# EAGLE design H08R61 (EAGLE 9.6.1)

## Sheet 1 of 2
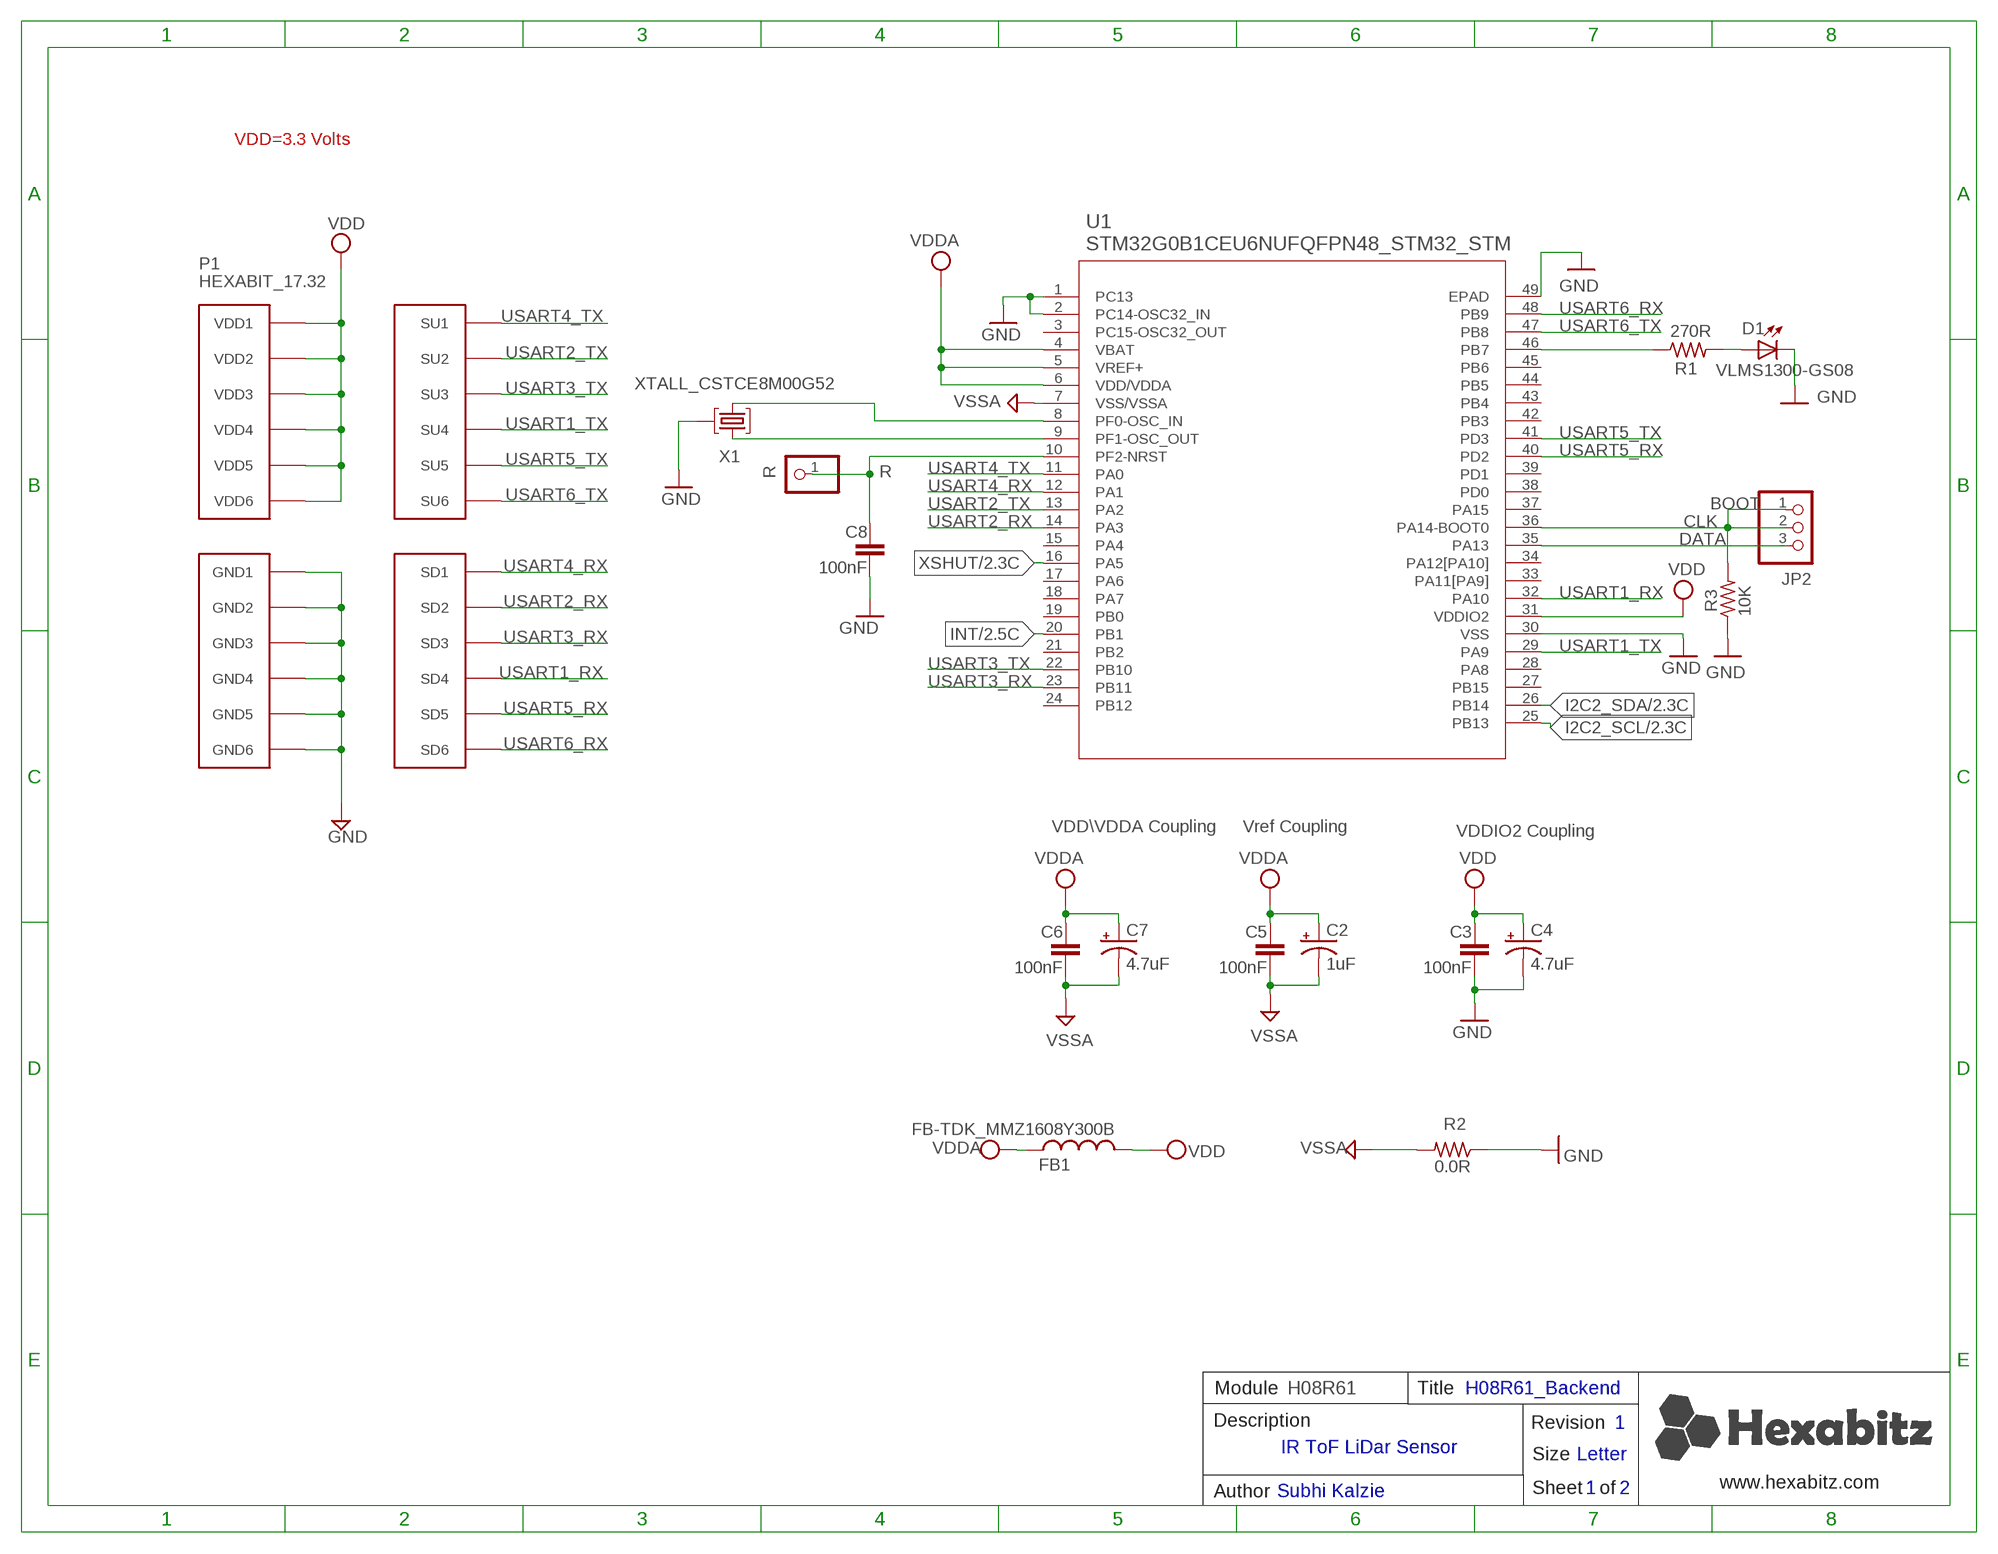
[diagram p0: schematic, sheet 1]

### Parts
C2  1uF  C-0805-POL  [C-0805-POL]
C3  100nF  C-0603  [C-0603]
C4  4.7uF  C-0805-POL  [C-0805-POL]
C5  100nF  C-0603  [C-0603]
C6  100nF  C-0603  [C-0603]
C7  4.7uF  C-0805-POL  [C-0805-POL]
C8  100nF  C-0603  [C-0603]
D1  VLMS1300-GS08  [VLMS1300-GS08]
FB1  FB-TDK_MMZ1608Y300B  [FB-TDK_MMZ1608Y300B]
JP2  PINHD-1X3  [1X03]
P1  HEXABIT_17.32  [HEXABIT_17.32]
R  R  PINHD-1X1  [1X01]
R1  270R  R-0603  [R-0603]
R2  0.0R  R-0603  [R-0603]
R3  10K  R-0603  [R-0603]
U1  STM32G0B1CEU6NUFQFPN48_STM32_STM  [UFQFPN48_STM32_STM]
X1  XTALL_CSTCE8M00G52  [XTALL_CSTCE8M00G52]

### Nets
CLK: JP2.1 JP2.2 R3.2 U1.36(PA14-BOOT0)
DATA: JP2.3 U1.35(PA13)
GND: C3.2 C4.2(-) C8.2 D1.C P1.PAD_PD7(GND1) P1.PAD_PD8(GND2) P1.PAD_PD9(GND3) P1.PAD_PD10(GND4) P1.PAD_PD11(GND5) P1.PAD_PD12(GND6) R2.1 R3.1 U1.1(PC13) U1.2(PC14-OSC32_IN) U1.30(VSS) U1.49(EPAD) X1.P$2 ; also sheet 2
I2C2_SCL: U1.25(PB13) ; also sheet 2
I2C2_SDA: U1.26(PB14) ; also sheet 2
INT: U1.20(PB1) ; also sheet 2
N$3: D1.A R1.2
N$4: C8.1 R.1 U1.10(PF2-NRST)
N$5: U1.9(PF1-OSC_OUT) X1.P$1
N$6: U1.8(PF0-OSC_IN) X1.P$3
N$7: R1.1 U1.46(PB7)
USART1_RX: P1.PAD_PD4(SD4) U1.32(PA10)
USART1_TX: P1.PAD_PU4(SU4) U1.29(PA9)
USART2_RX: P1.PAD_PD2(SD2) U1.14(PA3)
USART2_TX: P1.PAD_PU2(SU2) U1.13(PA2)
USART3_RX: P1.PAD_PD3(SD3) U1.23(PB11)
USART3_TX: P1.PAD_PU3(SU3) U1.22(PB10)
USART4_RX: P1.PAD_PD1(SD1) U1.12(PA1)
USART4_TX: P1.PAD_PU1(SU1) U1.11(PA0)
USART5_RX: P1.PAD_PD5(SD5) U1.40(PD2)
USART5_TX: P1.PAD_PU5(SU5) U1.41(PD3)
USART6_RX: P1.PAD_PD6(SD6) U1.48(PB9)
USART6_TX: P1.PAD_PU6(SU6) U1.47(PB8)
VDD: C3.1 C4.1(+) FB1.2 P1.PAD_PU7(VDD1) P1.PAD_PU8(VDD2) P1.PAD_PU9(VDD3) P1.PAD_PU10(VDD4) P1.PAD_PU11(VDD5) P1.PAD_PU12(VDD6) U1.31(VDDIO2) ; also sheet 2
VDDA: C2.1(+) C5.1 C6.1 C7.1(+) FB1.1 U1.4(VBAT) U1.5(VREF+) U1.6(VDD/VDDA) ; also sheet 2
VSSA: C2.2(-) C5.2 C6.2 C7.2(-) R2.2 U1.7(VSS/VSSA)
XSHUT: U1.16(PA5) ; also sheet 2
Unconnected: U1.3(PC15-OSC32_OUT) U1.15(PA4) U1.17(PA6) U1.18(PA7) U1.19(PB0) U1.21(PB2) U1.24(PB12) U1.27(PB15) U1.28(PA8) U1.33(PA11[PA9]) U1.34(PA12[PA10]) U1.37(PA15) U1.38(PD0) U1.39(PD1) U1.42(PB3) U1.43(PB4) U1.44(PB5) U1.45(PB6)

### Notes on the sheet
- VDD=3.3 Volts
- BOOT
- VDD\VDDA Coupling | Vref Coupling | VDDIO2 Coupling
- Module | H08R61 | Title | H08R61_Backend
- Description | Revision | 1
- IR ToF LiDar Sensor
- Size | Letter
- www.hexabitz.com
- Author | Subhi Kalzie | Sheet   of | 1 | 2
- C:/Users/Admin/Desktop/logodraft.bmp

## Sheet 2 of 2
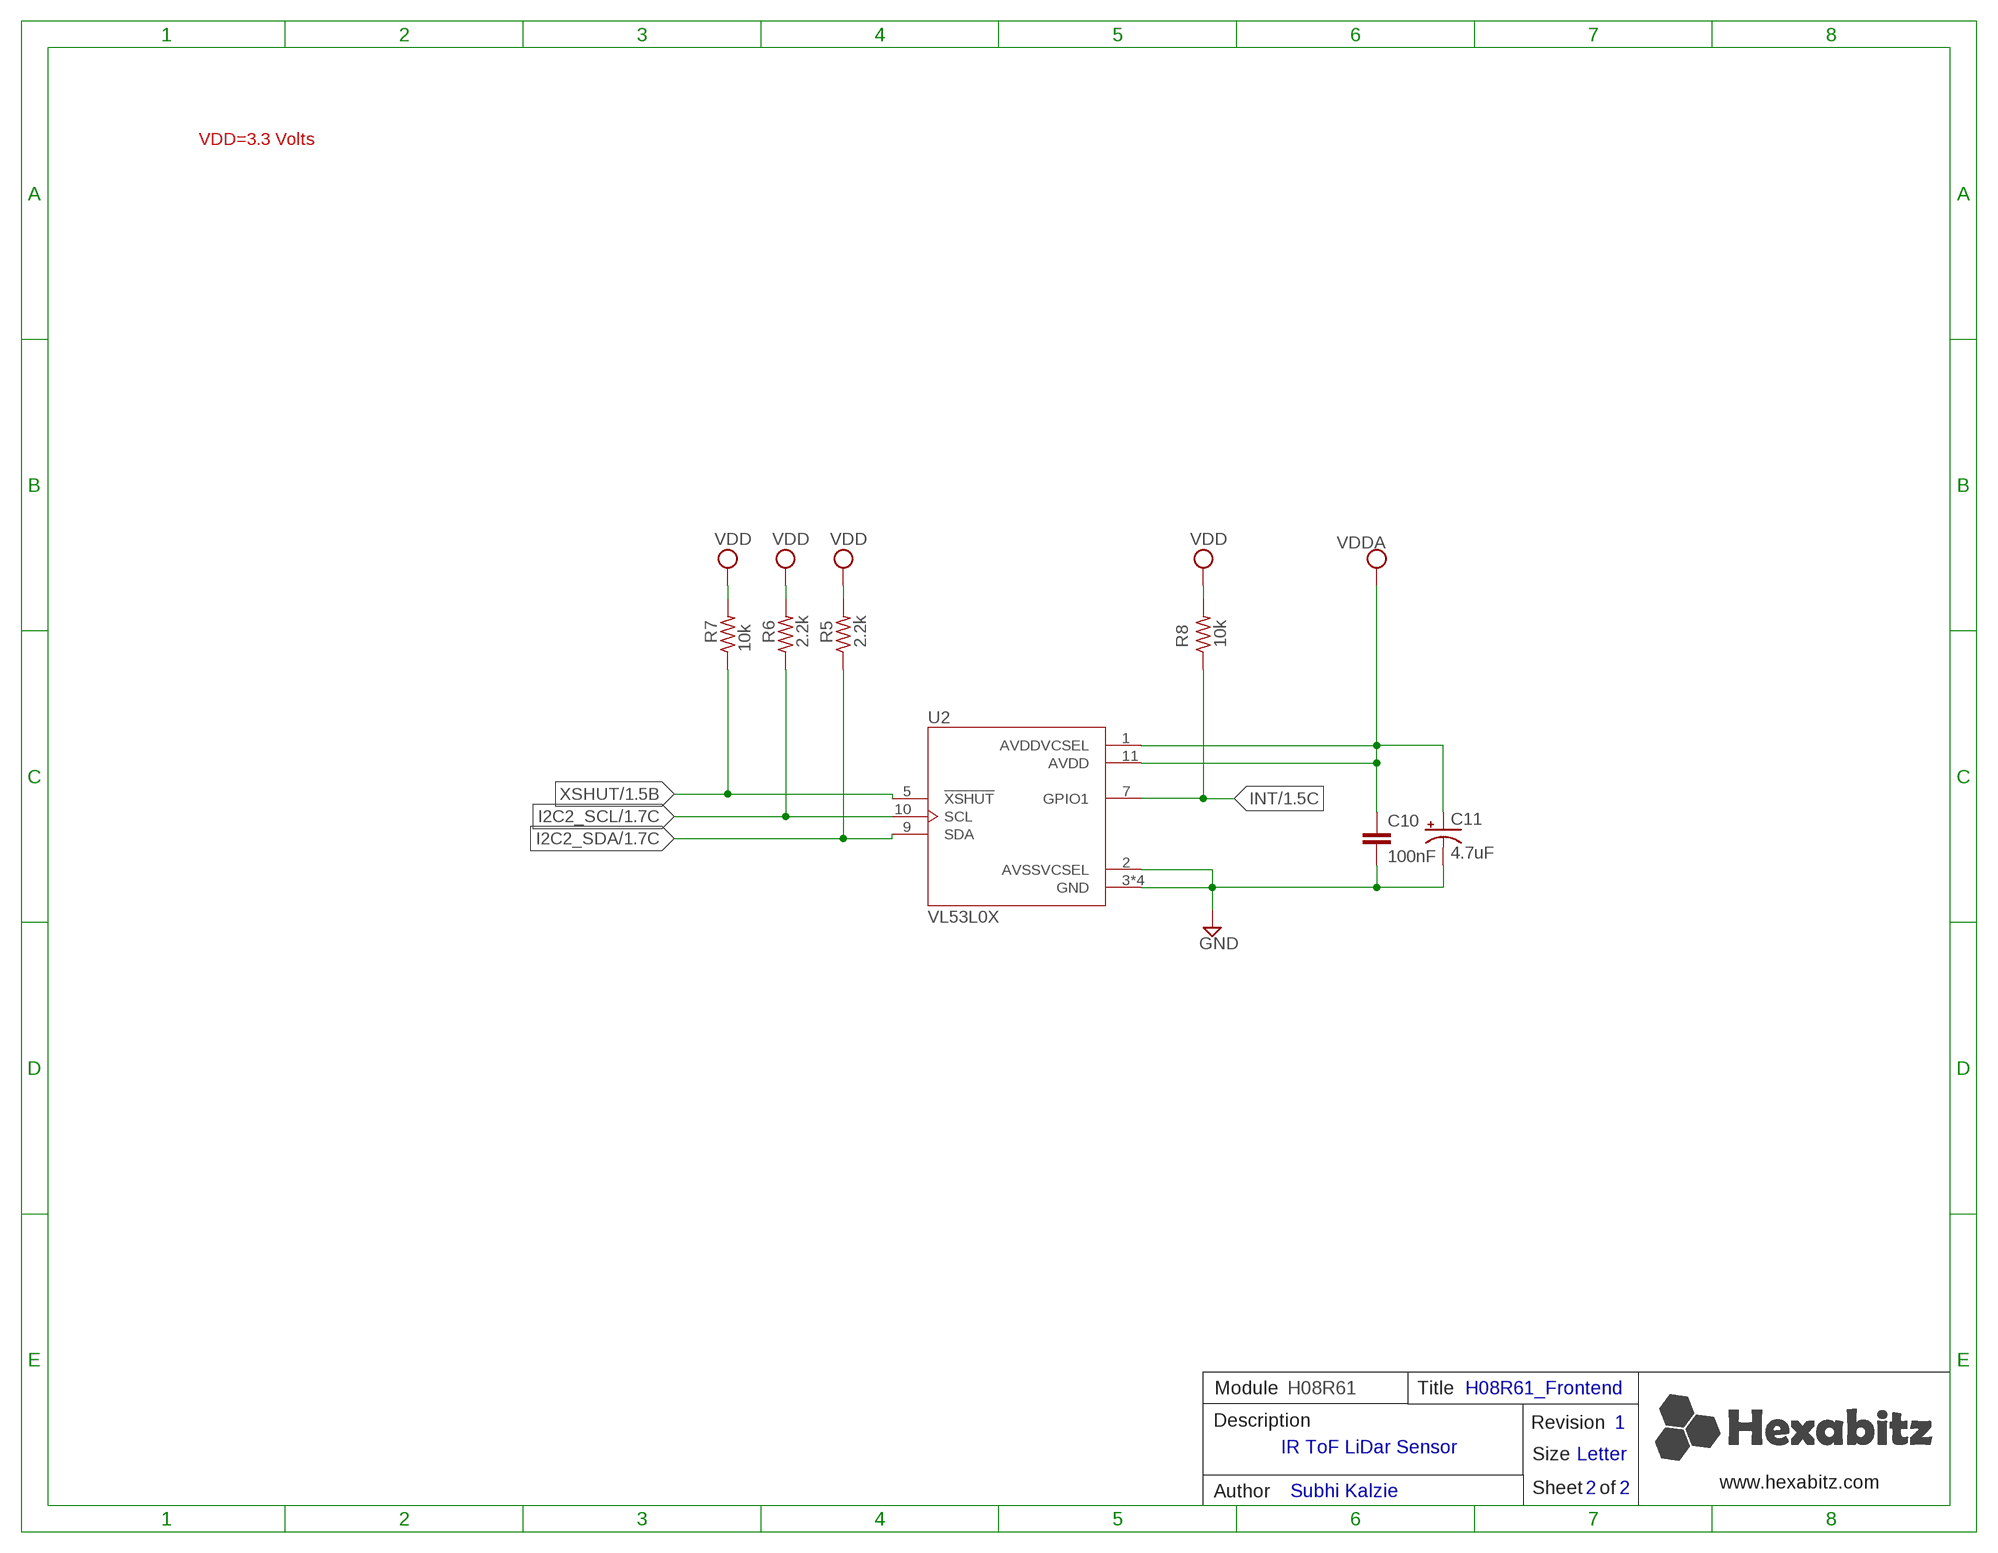
[diagram p1: schematic, sheet 2]

### Parts
C10  100nF  C-0603  [C-0603]
C11  4.7uF  C-0805-POL  [C-0805-POL]
R5  2.2k  R-0603  [R-0603]
R6  2.2k  R-0603  [R-0603]
R7  10k  R-0603  [R-0603]
R8  10k  R-0603  [R-0603]
U2  VL53L0X  [SENSOR_VL53L0X]

### Nets
GND: C10.2 C11.2(-) U2.2(AVSSVCSEL) U2.3(GND) U2.4(GND) U2.6(GND) U2.12(GND) ; also sheet 1
I2C2_SCL: R6.1 U2.10(SCL) ; also sheet 1
I2C2_SDA: R5.1 U2.9(SDA) ; also sheet 1
INT: R8.1 U2.7(GPIO1) ; also sheet 1
VDD: R5.2 R6.2 R7.2 R8.2 ; also sheet 1
VDDA: C10.1 C11.1(+) U2.1(AVDDVCSEL) U2.11(AVDD) ; also sheet 1
XSHUT: R7.1 U2.5(!XSHUT) ; also sheet 1

### Notes on the sheet
- VDD=3.3 Volts
- Module | H08R61 | Title | H08R61_Frontend
- Description | Revision | 1
- IR ToF LiDar Sensor
- Size | Letter
- www.hexabitz.com
- Author | Subhi Kalzie | Sheet   of | 2 | 2

## Library data of the parts
C2 C4 C7 C11 = HEXABITZ_RCLS:C-0805-POL: Cap Tant Solid SMD 2012
C3 C5 C6 C8 C10 = HEXABITZ_RCLS:C-0603: CAP CER 10% X7R 0603
D1 = Hexabitz:VLMS1300-GS08: Red 0603 130° Clear 54 mcd 2 V Surface Mount ChipLED ; Octopart Url : http://octopart.com/vlms1300-gs08-vishay-21709201; MFN: Vishay; MPN: VLMS1300-GS08; OCTOPART_URL: https://octopart.com/vlms1300-gs08-vishay-21709201?r=sp&s=_gcP4_q8T1SC6PJQPTQ9yA
FB1 = HEXABITZ_RCLS:FB-TDK_MMZ1608Y300B: Ferrite Beads Multi-Layer 30Ohm 25% 100MHz 1.5A 50mOhm DCR 0603; MFN: TDK; MPN: MMZ1608Y300B; OCTOPART_URL: https://octopart.com/mmz1608y300b-tdk-368280?r=sp&s=cd9_2ZEqQ9q9UNBuQgHAiA
JP2 = pinhead:PINHD-1X3: PIN HEADER
P1 = hexabitz_connectors:HEXABIT_?: Hexabitz Hexagon Module Connector Hexagon side length = 28.87mm.
R = HEXABITZ_USER_INTERFACE_PARTS:PINHD-1X1: PIN HEADER; MFN: TE Connectivity; MPN: 87227-1; OCTOPART_URL: https://octopart.com/87227-1-te+connectivity-39512052?r=sp
R1 R3 R5-R8 = HEXABITZ_RCLS:R-0603: Thick Film Resistors - SMD 0603
R2 = HEXABITZ_RCLS:R-0603: Thick Film Resistors - SMD 0603; MFN: Yageo; MPN: RC0603JR-070RL; OCTOPART_URL: https://octopart.com/rc0603jr-070rl-yageo-1241539?r=sp&s=X2NteqRjRNWrnx42Y0aliA; RESISTANCE: 0.0 Ohm
U1 = HEXABITZ_ICs:STM32G0B1CEU6N; COPYRIGHT: Copyright (C) 2022 Ultra Librarian. All rights reserved.; MFN: STMicroelectronics; MPN: STM32G0B1CEU6N; OCTOPART_URL: https://app.ultralibrarian.com/details/c038d58b-752a-11eb-9033-0a34d6323d74/STMicroelectronics/STM32G0B1CEU6N?uid=116364672
U2 = HEXABITZ_ICs:VL53L0X: Time-of-Flight Ranging & Gesture Detection Sensor; MFN: STMicroelectronics; MPN: VL53L0CXV0DH/1; OCTOPART_URL: http://octopart.com/vl53l0cxv0dh%2F1-stmicroelectronics-71168165
X1 = Hexabitz:XTALL_CSTCE8M00G52: MURATA CSTCE8M00G52-R0 RESONATOR, SMD, 8MHZ ; Octopart Url : https://octopart.com/cstce8m00g52-r0-murata-7145559; MFN: Murata; MPN: CSTCE8M00G52Z-R0; OCTOPART_URL: https://octopart.com/cstce8m00g52z-r0-murata-17755941?r=sp&s=JDnNJnrHQhyS8Zk4ofFWXw

## Board
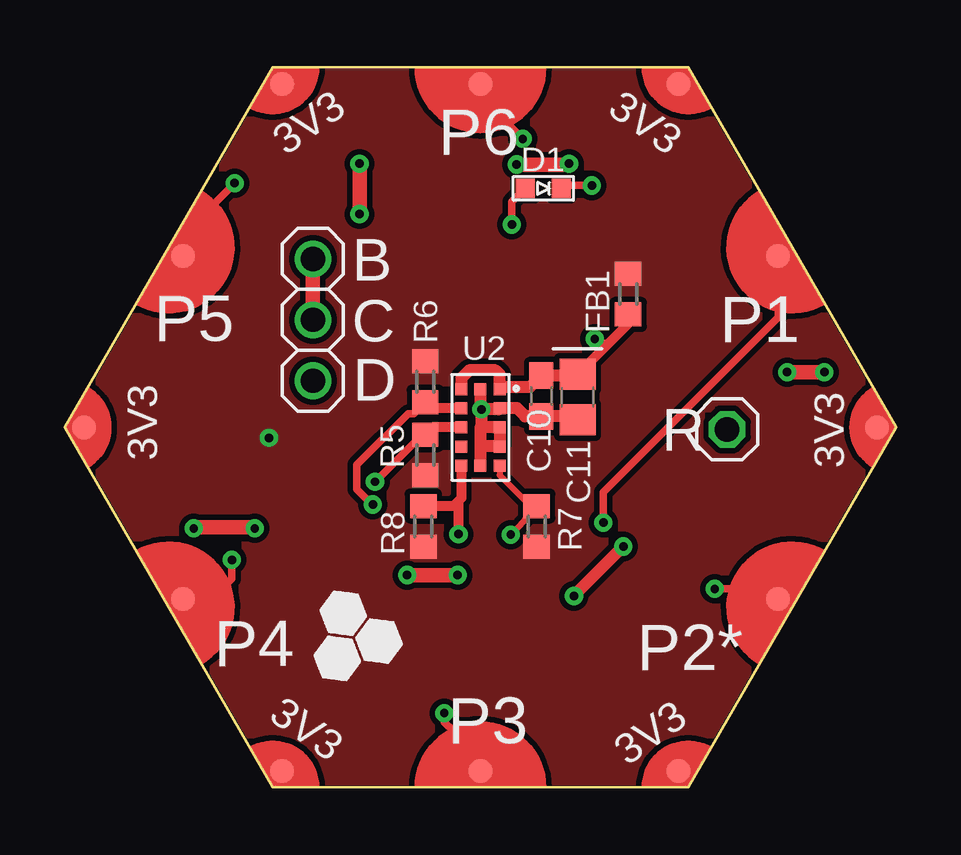
[diagram p2: board, top side]
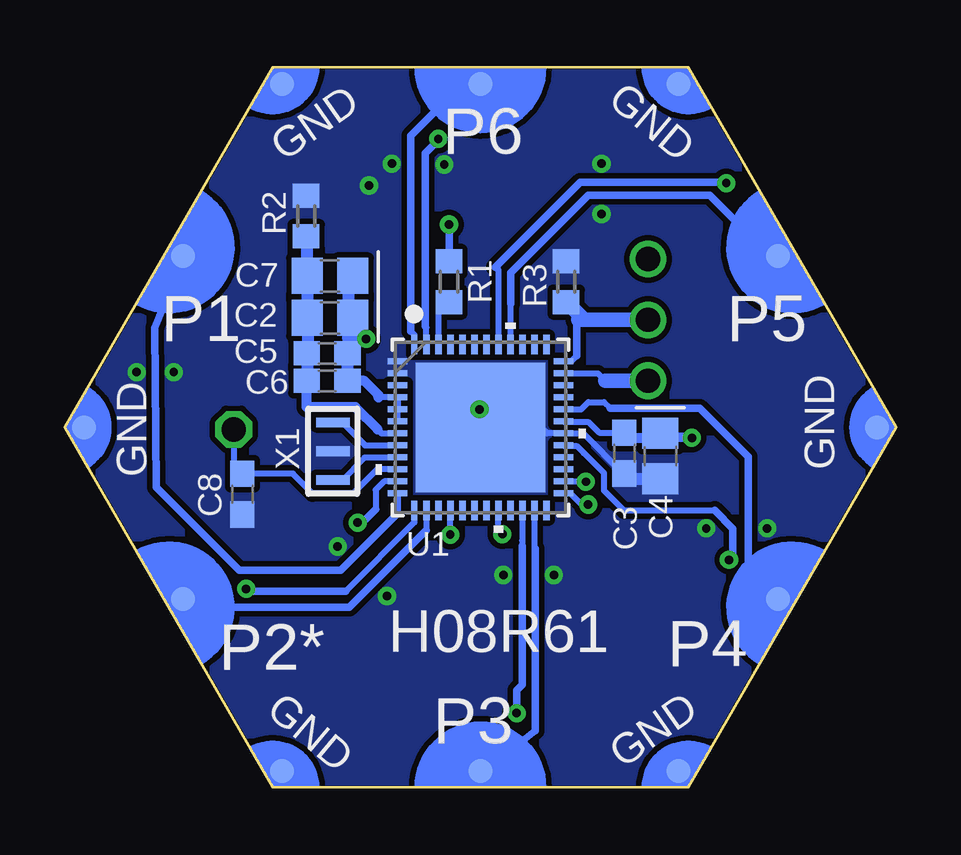
[diagram p3: board, bottom side, seen from below]

Size 34.64 x 30 mm. Coordinates in mm from the lower left corner, seen from the top.
Copper layers (1*16): Top 0.035mm / dielectric 1.5mm / Bottom 0.035mm
Design rules "default *": minimum track width 6mil, minimum drill 0.35mm, track to track 9mil, track to pad 9mil, pad to pad 6mil, via to via 6mil, smd to smd 0mil, copper to edge 1mil, drill to drill 1mil, minimum pad ring 10mil, minimum via ring 8mil, stop-mask expansion 4mil, vias tented up to drill 25mil, thermal gap 10mil

### Footprints (pad centres in the part's own frame; a part is rotated, then mirrored left to right if it is on the bottom)
C-0805-POL = smd 1.3 x 1.5: 1 -0.95,0; 2 0.95,0
C-0603 = smd 1.1 x 1: 1 -0.85,0; 2 0.85,0
VLMS1300-GS08 = smd 0.8 x 0.8: A 0,0.75; C 0,-0.75
FB-TDK_MMZ1608Y300B = smd 1 x 1.1: 1 -0.85,0; 2 0.85,0
1X03 = drill 1.016: 1 -2.54,0; 2 0,0; 3 2.54,0
HEXABIT_17.32 = smd 1 x 1 bottom: PAD_PD1 12.39,7.15; PAD_PD2 12.39,-7.15; PAD_PD3 0,-14.31; PAD_PD4 -12.39,-7.15; PAD_PD5 -12.39,7.15; PAD_PD6 0,14.31; PAD_PD7 8.26,14.31; PAD_PD8 16.52,0; PAD_PD9 8.26,-14.31; PAD_PD10 -8.26,-14.31; PAD_PD11 -16.52,0; PAD_PD12 -8.26,14.31 | smd 1 x 1: PAD_PU1 12.39,7.15; PAD_PU2 12.39,-7.15; PAD_PU3 0,-14.31; PAD_PU4 -12.39,-7.15; PAD_PU5 -12.39,7.15; PAD_PU6 0,14.31; PAD_PU7 8.26,14.31; PAD_PU8 16.52,0; PAD_PU9 8.26,-14.31; PAD_PU10 -8.26,-14.31; PAD_PU11 -16.52,0; PAD_PU12 -8.26,14.31
1X01 = drill 1.016 octagon: 1 0,0
R-0603 = smd 1 x 1.1: 1 -0.85,0; 2 0.85,0
UFQFPN48_STM32_STM = smd 0.813 x 0.254: 1 -3.454,2.751; 2 -3.454,2.251; 3 -3.454,1.75; 4 -3.454,1.25; 5 -3.454,0.75; 6 -3.454,0.25; 7 -3.454,-0.25; 8 -3.454,-0.75; 9 -3.454,-1.25; 10 -3.454,-1.75; 11 -3.454,-2.251; 12 -3.454,-2.751; 25 3.454,-2.751; 26 3.454,-2.251; 27 3.454,-1.75; 28 3.454,-1.25; 29 3.454,-0.75; 30 3.454,-0.25; 31 3.454,0.25; 32 3.454,0.75; 33 3.454,1.25; 34 3.454,1.75; 35 3.454,2.251; 36 3.454,2.751 | smd 0.254 x 0.813: 13 -2.751,-3.454; 14 -2.251,-3.454; 15 -1.75,-3.454; 16 -1.25,-3.454; 17 -0.75,-3.454; 18 -0.25,-3.454; 19 0.25,-3.454; 20 0.75,-3.454; 21 1.25,-3.454; 22 1.75,-3.454; 23 2.251,-3.454; 24 2.751,-3.454; 37 2.751,3.454; 38 2.251,3.454; 39 1.75,3.454; 40 1.25,3.454; 41 0.75,3.454; 42 0.25,3.454; 43 -0.25,3.454; 44 -0.75,3.454; 45 -1.25,3.454; 46 -1.75,3.454; 47 -2.251,3.454; 48 -2.751,3.454 | smd 5.385 x 5.385: 49 0,0
SENSOR_VL53L0X = smd 0.5 x 0.5: 1 -1.6,0.8; 2 -0.8,0.8; 3 0,0.8; 4 0.8,0.8; 5 1.6,0.8; 6 1.6,0; 7 1.6,-0.8; 8 0.8,-0.8; 9 0,-0.8; 10 -0.8,-0.8; 11 -1.6,-0.8; 12 -1.6,0
XTALL_CSTCE8M00G52 = smd 1.4 x 0.4: P$1 0,1.2; P$2 0,0; P$3 0,-1.2

### Placement (x,y rotation side)
C2  23.59,19.56 180 bottom
C3  11.33,13.93 270 bottom
C4  9.82,13.81 270 bottom
C5  23.71,18.1 180 bottom
C6  23.71,16.94 180 bottom
C7  23.59,21.31 180 bottom
C8  27.24,12.22 270 bottom
C10  19.86,16.31 270 top
C11  21.37,16.27 270 top
D1  19.94,24.96 90 top
FB1  23.47,20.56 90 top
JP2  10.34,19.48 270 top
P1  17.32,15 0 top
R  27.6,14.92 0 top
R1  18.63,21.07 90 bottom
R2  24.58,23.81 270 bottom
R3  13.75,21.07 270 bottom
R5  15.02,13.85 270 top
R6  15.02,16.91 90 top
R7  19.66,10.87 270 top
R8  14.94,10.87 270 top
U1  17.32,15 0 bottom
U2  17.32,15 270 top
X1  23.47,14.01 180 bottom

### Tracks (layer width: path | path; a pad name or v marks a point on that pad's centre or on a via)
CLK
  Top 0.61: JP2.2 JP2.1
  Bottom 0.254: 13.31,17.98 13.54,17.75 U1.36
  Bottom 0.305: 13.13,19.6 13.25,19.48 13.31,19.42 13.31,17.98
  Bottom 0.61: R3.2 13.13,19.6 | JP2.2 13.25,19.48
DATA
  Bottom 0.254: U1.35 12.43,17.25 12.12,16.95
  Bottom 0.61: JP2.3 12.12,16.95
GND  (via drill 0.35)
  Top 0.254: 16.43,8.79 v16.37,8.85 | v21.01,25.99 20.97,25.95
  Top 0.305: v21.96,25.08 20.81,25.08 D1.C
  Top 0.508: C11.2 21.23,15.46 C10.2 19.19,15.46 18.84,15.8 U2.2 18.07,15.75 v17.36,15.75 | U2.12 17.32,15.75 v17.36,15.75 | v23.27,10.04 v21.21,7.98 | v17.36,15.75 17.36,15 | 17.32,14.21 U1.49 17.36,15 | 17.32,14.21 U2.6 | 17.36,15 U2.3 U2.4 17.32,14.21
  Top 0.61: v5.37,10.79 5.41,10.83 7.87,10.83 v7.91,10.79 | v16.37,8.85 v14.26,8.85 | v31.65,17.3 v30.1,17.3 | v12.28,25.99 v12.28,23.89 | 20.97,25.95 v18.83,25.95
  Bottom 0.254: C3.2 11.36,13.08 13.03,14.75 U1.30 14.54,14.75 14.79,15 U1.49
  Bottom 0.406: C3.2 11.07,12.82
  Bottom 0.508: C3.2 11.11,12.86 C4.2
  pour Bottom (no thermals): 0.09,14.88 8.55,30.04 26.04,30.04 34.62,14.95 26.08,0.08 8.75,0.08
I2C2_SCL  (via drill 0.35)
  Top 0.305: R6.1 14.54,15.58 14.31,15.58 12.17,13.44 12.17,12.42 12.61,11.98 12.65,11.98 v12.84,11.79
  Top 0.406: U2.10 15.27,15.8 R6.1
  Bottom 0.254: U1.25 13.58,12.25 13.03,11.71 12.91,11.71 v12.84,11.79
I2C2_SDA  (via drill 0.35)
  Top 0.254: U2.9 16.44,15.08
  Top 0.305: v12.93,12.73 14.89,14.7 R5.1
  Top 0.406: U2.9 15.32,15 R5.1
  Bottom 0.254: U1.26 12.94,12.75 v12.93,12.73
INT  (via drill 0.35)
  Top 0.254: 14.94,11.74 R8.1
  Top 0.406: U2.7 16.52,12.06 16.41,11.94 | R8.1 16.19,11.72 16.41,11.94 | v16.41,10.55 16.41,11.94
  Bottom 0.254: v16.41,10.55 16.57,10.72 U1.20
N$3  (via drill 0.35)
  Top 0.305: v18.63,23.45 18.63,24.4 D1.A
  Bottom 0.305: v18.63,23.45 R1.2
N$4
  Bottom 0.254: U1.10 21.63,13.25 22.62,12.25 24.32,12.25 25.14,13.07 C8.1 27.6,13.43 R.1
N$5
  Bottom 0.254: U1.9 22.14,13.75 23.08,12.81 X1.P$1
N$6
  Bottom 0.254: X1.P$3 23.08,15.21 22.13,14.25 U1.8
N$7
  Bottom 0.254: U1.46 19.07,19.79 R1.1
USART1_RX
  Bottom 0.254: P1.PAD_PD4 6.17,9.09 | U1.32 13.12,15.75 12.82,16.05 12.17,16.05 11.92,15.79
  Bottom 0.305: 6.17,9.09 6.17,13.77 8.19,15.79 11.92,15.79
USART1_TX  (via drill 0.35)
  Top 0.254: P1.PAD_PU4 6.12,7.85
  Top 0.305: v6.96,9.48 6.96,8.69 6.12,7.85
  Bottom 0.254: U1.29 13.85,14.23 13.31,14.23 13.02,13.95 12.18,13.11 12.18,12.38 11.35,11.55 7.56,11.55
  Bottom 0.305: 7.56,11.55 6.8,10.79 6.8,9.64 v6.96,9.48
USART2_RX
  Bottom 0.254: U1.14 19.57,10.72 | P1.PAD_PD2 29.36,7.5
  Bottom 0.305: 19.57,10.72 22.79,7.5 29.36,7.5
USART2_TX  (via drill 0.35)
  Top 0.254: P1.PAD_PU2 29.36,8.2 28.19,8.2 28.12,8.28
  Top 0.305: 28.12,8.28 v27.08,8.28
  Bottom 0.254: v27.08,8.28 27.08,8.17 | U1.13 20.07,11.04 22.94,8.17
  Bottom 0.305: 27.08,8.17 22.94,8.17
USART3_RX
  Bottom 0.254: P1.PAD_PD3 17.08,0.69 16.74,1.04 | U1.23 15.07,9.99 15.03,9.95
  Bottom 0.305: 16.74,1.04 15.03,2.36 15.03,9.95
USART3_TX  (via drill 0.35)
  Top 0.254: P1.PAD_PU3 17.32,1.66
  Top 0.305: 17.32,1.66 15.98,2.55 15.81,2.71 v15.81,3.09
  Bottom 0.254: U1.22 15.57,10.29 15.58,10.28 15.58,10.08
  Bottom 0.305: v15.81,3.09 15.81,4.05 15.58,4.28 15.58,10.08
USART4_RX
  Bottom 0.254: U1.12 20.77,11.42 | P1.PAD_PD1 29.71,21.36 30.18,20.89
  Bottom 0.305: 20.77,11.42 23.14,9.05 27.37,9.05 30.83,12.52 30.89,19.14 30.18,20.89
USART4_TX  (via drill 0.35)
  Top 0.254: 29.71,19.57 P1.PAD_PU1 | 26.21,16.07
  Top 0.305: 26.21,16.07 22.44,12.3 v22.44,11.03 | 26.21,16.07 29.71,19.57
  Bottom 0.254: U1.11 21.33,12.75 21.69,12.39 21.69,11.59 | 22.1,11.17 arc45 v22.44,11.03
  Bottom 0.305: 21.69,11.59 22.1,11.17
USART5_RX
  Bottom 0.254: P1.PAD_PD5 5.3,22.52 5.6,22.52 | 16.06,20.16 16.07,20.15 U1.40
  Bottom 0.305: 5.6,22.52 7.76,24.68 12.82,24.68 16.06,21.44 16.06,20.16
USART5_TX  (via drill 0.35)
  Top 0.254: 5.41,23.51 5.41,22.8 4.93,22.32 P1.PAD_PU5
  Top 0.305: v7.08,25.18 5.41,23.51
  Bottom 0.254: 16.7,21.68 16.57,21.55 U1.41
  Bottom 0.305: v7.08,25.18 7.12,25.22 13.17,25.22 16.7,21.68
USART6_RX
  Bottom 0.254: 20.23,19.01 20.07,18.85 U1.48 | P1.PAD_PD6 18.07,29.31
  Bottom 0.305: 20.23,19.01 20.23,27.16 18.07,29.31
USART6_TX  (via drill 0.35)
  Top 0.305: P1.PAD_PU6 17.32,28.79 v19.08,27.03
  Bottom 0.254: U1.47 19.57,19.16 19.62,19.21
  Bottom 0.305: 19.62,19.21 19.62,26.43 19.08,26.97 v19.08,27.03
VDD  (via drill 0.35)
  Bottom 0.254: U1.31 13.85,15.23 12.83,15.23 12.38,14.78 C3.1
  Bottom 0.406: C3.1 11.13,14.58 10,14.58 C4.1 9.66,14.6 8.55,14.6 v8.51,14.56
  pour Top (no thermals): 0.04,15.06 8.42,30.08 26.04,30.08 34.67,14.9 26,0.08 8.49,0.08
VDDA  (via drill 0.35)
  Top 0.406: C11.1 22.6,18.45 | 22.6,18.45 23.47,19.32 FB1.1 | 22.6,18.45 22.32,18.45 v22.08,18.69
  Top 0.508: U2.11 16.52,17.06 16.84,17.38 17.96,17.38 18.12,17.22 U2.1 18.2,16.68 19.38,16.68 C10.1 21.31,17.16 C11.1
  Bottom 0.254: U1.6 U1.5 U1.4 21.57,16.25
  Bottom 0.406: 21.57,16.25 21.57,16.35 22.16,16.95 C6.1 | v22.08,18.69 22.12,18.73 22.84,18.73
  Bottom 0.508: C7.1 22.84,21.11 22.84,19.76 C2.1 22.84,19.37 22.84,18.73 22.84,18.12 C5.1 C6.1
VSSA
  Bottom 0.254: 21.61,14.92 21.44,14.75 U1.7
  Bottom 0.406: 21.61,14.92 22.53,15.84 24.56,15.84 C6.2
  Bottom 0.508: C6.2 24.52,16.98 24.52,18.06 | C5.2 24.52,18.06 | 24.52,18.06 24.52,19.54 C2.2 C7.2 24.54,22.72 R2.2
XSHUT  (via drill 0.35)
  Top 0.254: U2.5 18.12,13.01 19.41,11.72 R7.1 18.91,10.86 v18.58,10.53
  Bottom 0.254: U1.16 18.57,10.55 v18.58,10.53

### Text on the board
tPlace: 3V3 | P6 | 3V3 | P5 | P1 | 3V3 | 3V3 | P4 | P2* | 3V3 | P3 | 3V3
bPlace: GND | P6 | GND | P5 | P1 | GND | GND | P4 | P2* | GND | P3 | GND
tNames: B | C | D
bNames: U1 | H08R61